# Altium project RuchnyyeChasy.PrjPcb
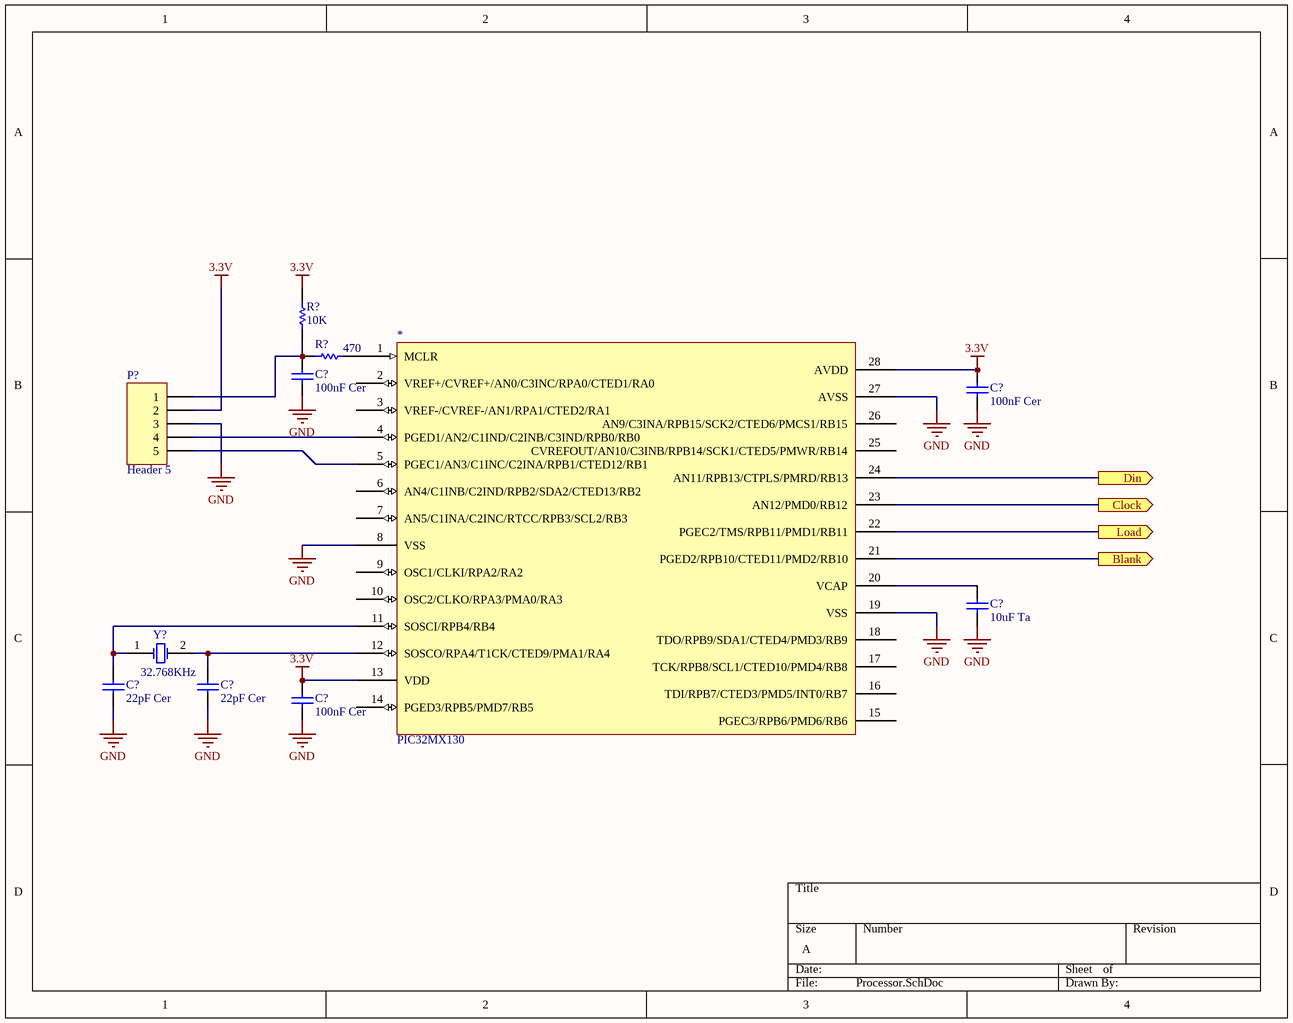
[diagram p0: Processor.SchDoc]
5 sheets, 48 parts. Net scope: flat (ports and power ports of the same name join across sheets).
Sheets:
  Processor.SchDoc
  Power.SchDoc
  Display.SchDoc
  Capacitive.SchDoc
  LED.SchDoc

## Sheet Processor.SchDoc
size A

### Parts
(Parts that share a designator on the sheet are numbered #1, #2 ... from top to bottom, then left to right.)
*#1  PIC32MX130
C?#1  100nF Cer  [RAD-0.3]
C?#2  100nF Cer  [RAD-0.3]
C?#3  10uF Ta  [RAD-0.3]
C?#4  22pF Cer  [RAD-0.3]
C?#5  22pF Cer  [RAD-0.3]
C?#6  100nF Cer  [RAD-0.3]
P?  Header 5  [HDR1X5]
R?#1  10K  [AXIAL-0.3]
R?#2  470  [AXIAL-0.3]
Y?  32.768KHz  [R38]

### Ports
Blank (out), Clock (out), Din (out), Load (out)

### Nets
3.3V: *#1.13(VDD) *#1.28(AVDD) C?#2.2 C?#6.2 P?.2 R?#1.2
GND: *#1.8(VSS) *#1.19(VSS) *#1.27(AVSS) C?#1.1 C?#2.1 C?#3.1 C?#4.1 C?#5.1 C?#6.1 P?.3
Net*#1_1: *#1.1(MCLR) R?#2.1
Net*#1_4: *#1.4(PGED1/AN2/C1IND/C2INB/C3IND/RPB0/RB0) P?.4
Net*#1_5: *#1.5(PGEC1/AN3/C1INC/C2INA/RPB1/CTED12/RB1) P?.5
Net*#1_11: *#1.11(SOSCI/RPB4/RB4) C?#4.2 Y?.1(OSC1)
Net*#1_12: *#1.12(SOSCO/RPA4/T1CK/CTED9/PMA1/RA4) C?#5.2 Y?.2(OSC2)
Net*#1_20: *#1.20(VCAP) C?#3.2
Net*#1_21: *#1.21(PGED2/RPB10/CTED11/PMD2/RB10) ; port Blank
Net*#1_22: *#1.22(PGEC2/TMS/RPB11/PMD1/RB11) ; port Load
Net*#1_23: *#1.23(AN12/PMD0/RB12) ; port Clock
Net*#1_24: *#1.24(AN11/RPB13/CTPLS/PMRD/RB13) ; port Din
NetC?#1_2: C?#1.2 P?.1 R?#1.1 R?#2.2

Not connected (* = marked no-connect by the designer): *#1 2(VREF+/CVREF+/AN0/C3INC/RPA0/CTED1/RA0) 3(VREF-/CVREF-/AN1/RPA1/CTED2/RA1) 6(AN4/C1INB/C2IND/RPB2/SDA2/CTED13/RB2) 7(AN5/C1INA/C2INC/RTCC/RPB3/SCL2/RB3) 9(OSC1/CLKI/RPA2/RA2) 10(OSC2/CLKO/RPA3/PMA0/RA3) 14(PGED3/RPB5/PMD7/RB5) 15(PGEC3/RPB6/PMD6/RB6) 16(TDI/RPB7/CTED3/PMD5/INT0/RB7) 17(TCK/RPB8/SCL1/CTED10/PMD4/RB8) 18(TDO/RPB9/SDA1/CTED4/PMD3/RB9) 25(CVREFOUT/AN10/C3INB/RPB14/SCK1/CTED5/PMWR/RB14) 26(AN9/C3INA/RPB15/SCK2/CTED6/PMCS1/RB15)

### Library data of the parts
C?#1-C?#6 = Cap: Capacitor; Value: 100pF; Published: 8-Jun-2000; LatestRevisionDate: 17-Jul-2002; LatestRevisionNote: Re-released for DXP Platform.; PackageReference: RAD-0.3; Publisher: Altium Limited; PackageDescription: Radial Cap, Thru-Hole; 2 Leads; 0.3 in Pin Spacing
P? = Header 5: Header, 5-Pin; LatestRevisionDate: 17-Jul-2002; LatestRevisionNote: Re-released for DXP Platform.; Publisher: Altium Limited
R?#1 R?#2 = Res1: Resistor; Value: 1K; Published: 8-Jun-2000; LatestRevisionDate: 17-Jul-2002; LatestRevisionNote: Re-released for DXP Platform.; PackageReference: AXIAL-0.3; Publisher: Altium Limited; PackageDescription: Axial Device, Thru-Hole; 2 Leads; 0.3 in Pin Spacing
Y? = XTAL: Crystal Oscillator; Published: 8-Jun-2000; LatestRevisionDate: 17-Jul-2002; LatestRevisionNote: Re-released for DXP Platform.; PackageReference: R38; Publisher: Altium Limited; PackageDescription: Crystal, Thru-Hole; 2 Leads; Body 3.1 x 8.2 mm (Dia.xH)

## Sheet Power.SchDoc
size A
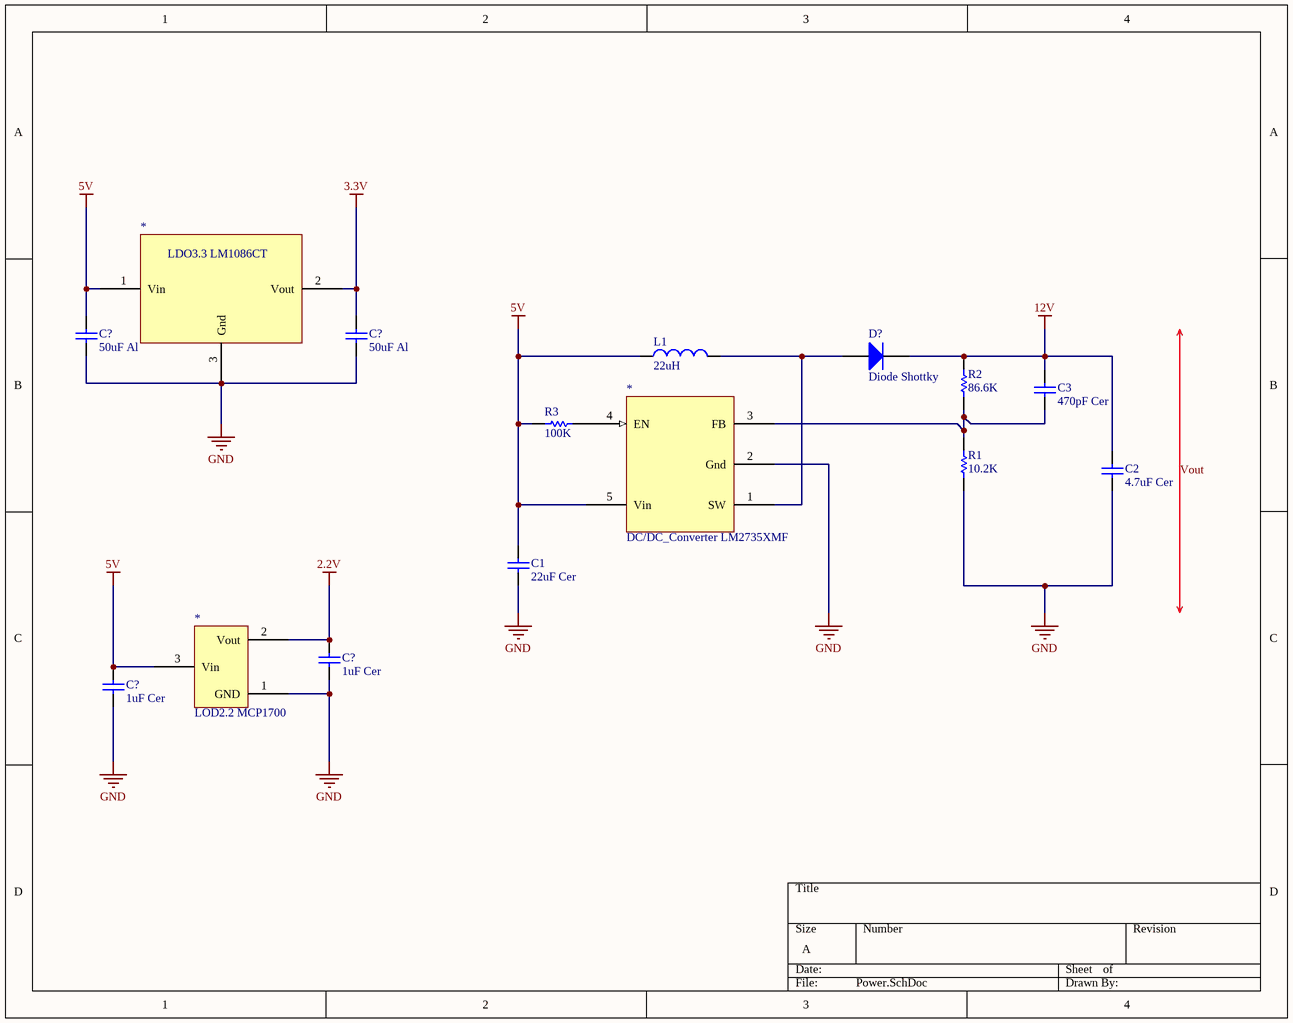
[diagram p1: Power.SchDoc]

### Parts
(Parts that share a designator on the sheet are numbered #1, #2 ... from top to bottom, then left to right.)
*#2  LDO3.3 LM1086CT
*#3  DC/DC_Converter LM2735XMF
*#4  LOD2.2 MCP1700
C1  22uF Cer  [RAD-0.3]
C2  4.7uF Cer  [RAD-0.3]
C3  470pF Cer  [RAD-0.3]
C?#7  50uF Al  [RAD-0.3]
C?#8  50uF Al  [RAD-0.3]
C?#9  1uF Cer  [RAD-0.3]
C?#10  1uF Cer  [RAD-0.3]
D?  Diode Shottky  [SMC]
L1  22uH  [0402-A]
R1  10.2K  [AXIAL-0.3]
R2  86.6K  [AXIAL-0.3]
R3  100K  [AXIAL-0.3]

### Nets
2.2V: *#4.2(Vout) C?#9.2
3.3V: *#2.2(Vout) C?#8.2
5V: *#2.1(Vin) *#3.5(Vin) *#4.3(Vin) C1.2 C?#7.2 C?#10.2 L1.1 R3.1
12V: C2.2 C3.2 D?.2(K) R2.2
GND: *#2.3(Gnd) *#3.2(Gnd) *#4.1(GND) C1.1 C2.1 C?#7.1 C?#8.1 C?#9.1 C?#10.1 R1.1
Net*#3_1: *#3.1(SW) D?.1(A) L1.2
Net*#3_3: *#3.3(FB) C3.1 R1.2 R2.1
Net*#3_4: *#3.4(EN) R3.2

### Notes on the sheet
- Vout

### Library data of the parts
C1 = Cap: Capacitor; Published: 8-Jun-2000; LatestRevisionDate: 17-Jul-2002; LatestRevisionNote: Re-released for DXP Platform.; PackageReference: RAD-0.3; Publisher: Altium Limited; PackageDescription: Radial Cap, Thru-Hole; 2 Leads; 0.3 in Pin Spacing; Value: 22uF
C2 C?#7 C?#8 = Cap: Capacitor; Value: 10uF; Published: 8-Jun-2000; LatestRevisionDate: 17-Jul-2002; LatestRevisionNote: Re-released for DXP Platform.; PackageReference: RAD-0.3; Publisher: Altium Limited; PackageDescription: Radial Cap, Thru-Hole; 2 Leads; 0.3 in Pin Spacing
C3 = Cap: Capacitor; Value: 330pF; Published: 8-Jun-2000; LatestRevisionDate: 17-Jul-2002; LatestRevisionNote: Re-released for DXP Platform.; PackageReference: RAD-0.3; Publisher: Altium Limited; PackageDescription: Radial Cap, Thru-Hole; 2 Leads; 0.3 in Pin Spacing
C?#9 C?#10 = Cap: Capacitor; Value: 22uF; Published: 8-Jun-2000; LatestRevisionDate: 17-Jul-2002; LatestRevisionNote: Re-released for DXP Platform.; PackageReference: RAD-0.3; Publisher: Altium Limited; PackageDescription: Radial Cap, Thru-Hole; 2 Leads; 0.3 in Pin Spacing
D? = Diode: Default Diode; Published: 8-Jun-2000; LatestRevisionDate: 17-Jul-2002; LatestRevisionNote: Re-released for DXP Platform.; PackageVersion: Sep-1996; PackageReference: SMC; Publisher: Altium Limited; PackageDescription: DO-214-AB/SMC; 2 C-Bend Leads; Body 7.9 x 5.9 mm, inc. leads (LxW); Code_JEDEC: DO-214-AB
L1 = Inductor: Code_IEC: 1005; Value: 33uH; Published: 8-Jun-2000; LatestRevisionDate: 29-May-2009; LatestRevisionNote: IPC-7351 Footprint Added.; PackageReference: 0402-A; Publisher: Altium Limited; PackageDescription: Chip Inductor; Code_JEITA: 0402
R1-R3 = Res1: Resistor; Published: 8-Jun-2000; LatestRevisionDate: 17-Jul-2002; LatestRevisionNote: Re-released for DXP Platform.; PackageReference: AXIAL-0.3; Publisher: Altium Limited; PackageDescription: Axial Device, Thru-Hole; 2 Leads; 0.3 in Pin Spacing
  R1: Value: 10.2K
  R2: Value: 86.6K
  R3: Value: 100K

## Sheet Display.SchDoc
size A
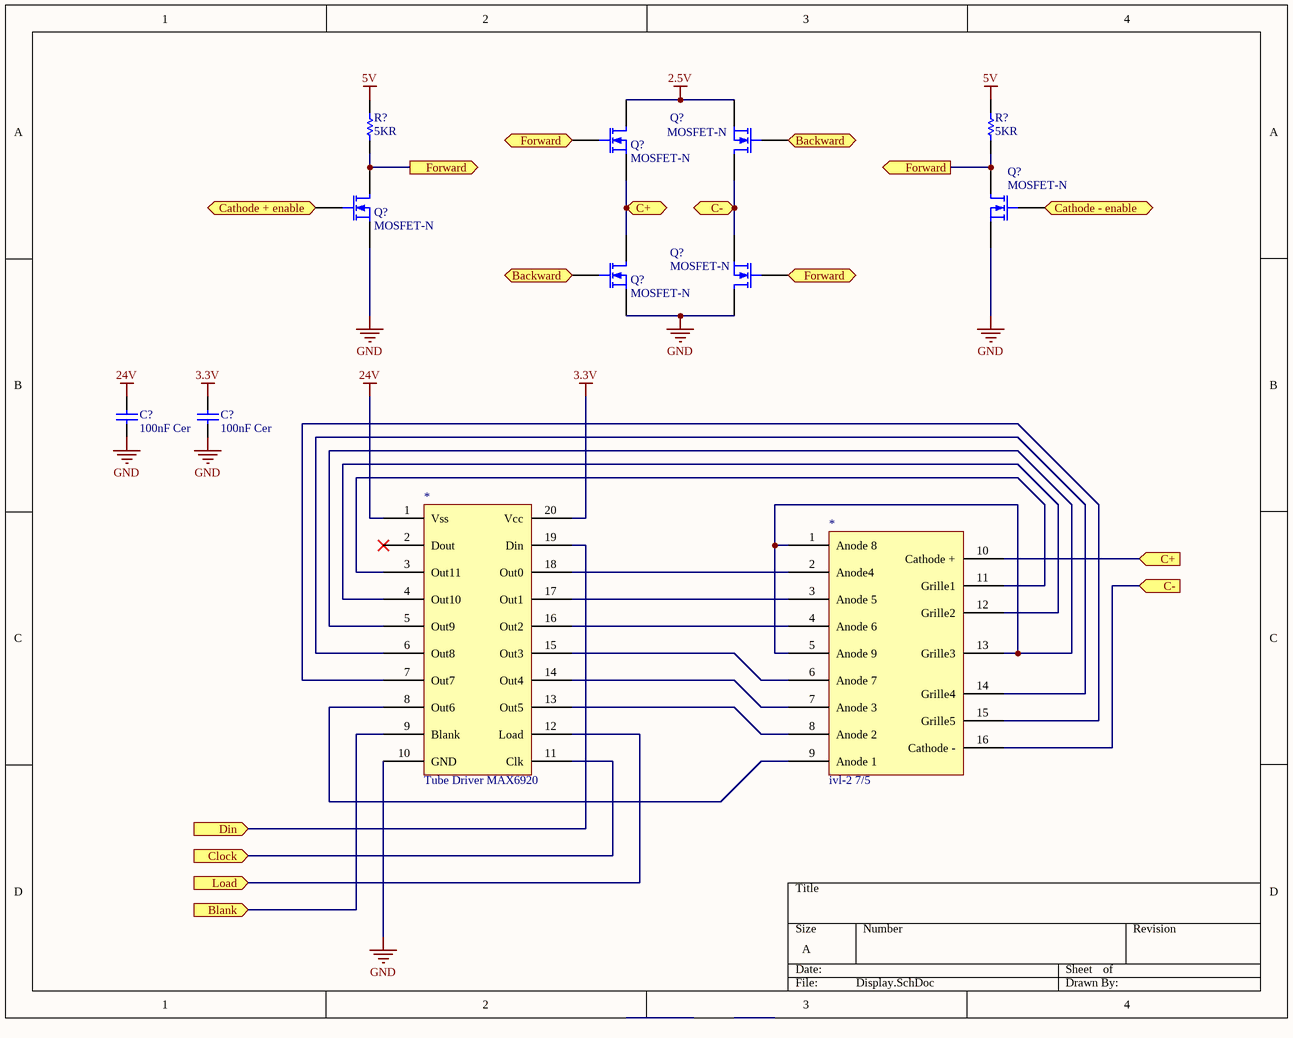
[diagram p2: Display.SchDoc]

### Parts
(Parts that share a designator on the sheet are numbered #1, #2 ... from top to bottom, then left to right.)
*#5  Tube Driver MAX6920
*#6  ivl-2 7/5
C?#11  100nF Cer  [RAD-0.3]
C?#12  100nF Cer  [RAD-0.3]
Q?#1  MOSFET-N  [E3]
Q?#2  MOSFET-N  [E3]
Q?#3  MOSFET-N  [E3]
Q?#4  MOSFET-N  [E3]
Q?#5  MOSFET-N  [E3]
Q?#6  MOSFET-N  [E3]
R?#3  5KR  [AXIAL-0.3]
R?#4  5KR  [AXIAL-0.3]

### Ports
Backward (in), Blank (in), C+ (in), C+ (out), C- (in), C- (out), Cathode + enable (in), Cathode - enable (in), Clock (in), Din (in), Forward (in), Forward (out), Load (in)

### Nets
2.5V: Q?#1.1(D) Q?#2.3(S)
3.3V: *#5.20(Vcc) C?#12.2
5V: R?#3.2 R?#4.2
24V: *#5.1(Vss) C?#11.2
GND: *#5.10(GND) C?#11.1 C?#12.1 Q?#3.3(S) Q?#4.3(S) Q?#5.3(S) Q?#6.1(D)
Net*#1_21: *#5.9(Blank) ; port Blank
Net*#1_22: *#5.12(Load) ; port Load
Net*#1_23: *#5.11(Clk) ; port Clock
Net*#1_24: *#5.19(Din) ; port Din
Net*#5_3: *#5.3(Out11) *#6.11(Grille1)
Net*#5_4: *#5.4(Out10) *#6.12(Grille2)
Net*#5_5: *#5.5(Out9) *#6.1(Anode_8) *#6.5(Anode_9) *#6.13(Grille3)
Net*#5_6: *#5.6(Out8) *#6.14(Grille4)
Net*#5_7: *#5.7(Out7) *#6.15(Grille5)
Net*#5_8: *#5.8(Out6) *#6.9(Anode_1)
Net*#5_13: *#5.13(Out5) *#6.8(Anode_2)
Net*#5_14: *#5.14(Out4) *#6.7(Anode_3)
Net*#5_15: *#5.15(Out3) *#6.6(Anode_7)
Net*#5_16: *#5.16(Out2) *#6.4(Anode_6)
Net*#5_17: *#5.17(Out1) *#6.3(Anode_5)
Net*#5_18: *#5.18(Out0) *#6.2(Anode4)
Net*#6_10: *#6.10(Cathode_+) Q?#1.3(S) Q?#5.1(D) ; port C+
Net*#6_16: *#6.16(Cathode_-) Q?#2.1(D) Q?#6.3(S) ; port C-
NetQ?#1_2: Q?#1.2(G) Q?#3.1(D) Q?#4.1(D) Q?#6.2(G) R?#3.1 R?#4.1 ; port Forward
NetQ?#2_2: Q?#2.2(G) Q?#5.2(G) ; port Backward
NetQ?#3_2: Q?#3.2(G) ; port Cathode + enable
NetQ?#4_2: Q?#4.2(G) ; port Cathode - enable

Not connected (* = marked no-connect by the designer): *#5 2(Dout)*

### Library data of the parts
C?#11 C?#12 = Cap: Capacitor; Value: 10uF; Published: 8-Jun-2000; LatestRevisionDate: 17-Jul-2002; LatestRevisionNote: Re-released for DXP Platform.; PackageReference: RAD-0.3; Publisher: Altium Limited; PackageDescription: Radial Cap, Thru-Hole; 2 Leads; 0.3 in Pin Spacing
Q?#1-Q?#6 = MOSFET-N: N-Channel MOSFET; Published: 8-Jun-2000; LatestRevisionDate: 17-Jul-2002; LatestRevisionNote: Re-released for DXP Platform.; PackageVersion: 1995/1996; PackageReference: E3; Publisher: Altium Limited; PackageDescription: TO, Flat Index; 3 In-Line, Axial Leads; Body Dia. 4.6mm; Lead Dia. 0.5 mm (max)
R?#3 R?#4 = Res1: Resistor; Value: 1K; Published: 8-Jun-2000; LatestRevisionDate: 17-Jul-2002; LatestRevisionNote: Re-released for DXP Platform.; PackageReference: AXIAL-0.3; Publisher: Altium Limited; PackageDescription: Axial Device, Thru-Hole; 2 Leads; 0.3 in Pin Spacing

## Sheet Capacitive.SchDoc
size A
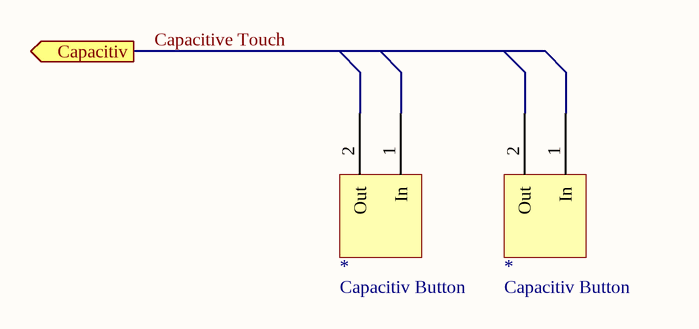
[diagram p3: Capacitive.SchDoc]

### Parts
(Parts that share a designator on the sheet are numbered #1, #2 ... from top to bottom, then left to right.)
*#7  Capacitiv Button
*#8  Capacitiv Button

### Ports
Capacitiv (out)

### Nets

Not connected (* = marked no-connect by the designer): *#7 1(In) 2(Out); *#8 1(In) 2(Out)

### Buses and harness runs
bus Capacitive Touch = port Capacitiv

## Sheet LED.SchDoc
size A
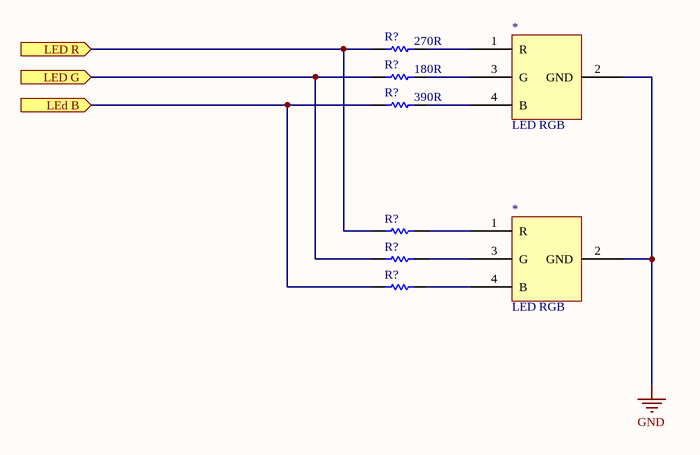
[diagram p4: LED.SchDoc]

### Parts
(Parts that share a designator on the sheet are numbered #1, #2 ... from top to bottom, then left to right.)
*#9  LED RGB
*#10  LED RGB
R?#5  270R  [AXIAL-0.3]
R?#6  180R  [AXIAL-0.3]
R?#7  390R  [AXIAL-0.3]
R?#8  (no value)  [AXIAL-0.3]
R?#9  (no value)  [AXIAL-0.3]
R?#10  (no value)  [AXIAL-0.3]

### Ports
LEd B (in), LED G (in), LED R (in)

### Nets
GND: *#9.2(GND) *#10.2(GND)
Net*#9_1: *#9.1(R) R?#5.2
Net*#9_3: *#9.3(G) R?#6.2
Net*#9_4: *#9.4(B) R?#7.2
Net*#10_1: *#10.1(R) R?#8.2
Net*#10_3: *#10.3(G) R?#9.2
Net*#10_4: *#10.4(B) R?#10.2
NetR?#5_1: R?#5.1 R?#8.1 ; port LED R
NetR?#6_1: R?#6.1 R?#9.1 ; port LED G
NetR?#7_1: R?#7.1 R?#10.1 ; port LEd B

### Library data of the parts
R?#5-R?#10 = Res1: Resistor; Value: 1K; Published: 8-Jun-2000; LatestRevisionDate: 17-Jul-2002; LatestRevisionNote: Re-released for DXP Platform.; PackageReference: AXIAL-0.3; Publisher: Altium Limited; PackageDescription: Axial Device, Thru-Hole; 2 Leads; 0.3 in Pin Spacing

## Nets that join several sheets
3.3V: Processor (6 pins), Power (*#2.2 C?#8.2), Display (*#5.20 C?#12.2)
5V: Power (8 pins), Display (R?#3.2 R?#4.2)
GND: Processor (10 pins), Power (10 pins), Display (7 pins), LED (*#9.2 *#10.2)
Net*#1_21: Processor (*#1.21), Display (*#5.9)
Net*#1_22: Processor (*#1.22), Display (*#5.12)
Net*#1_23: Processor (*#1.23), Display (*#5.11)
Net*#1_24: Processor (*#1.24), Display (*#5.19)